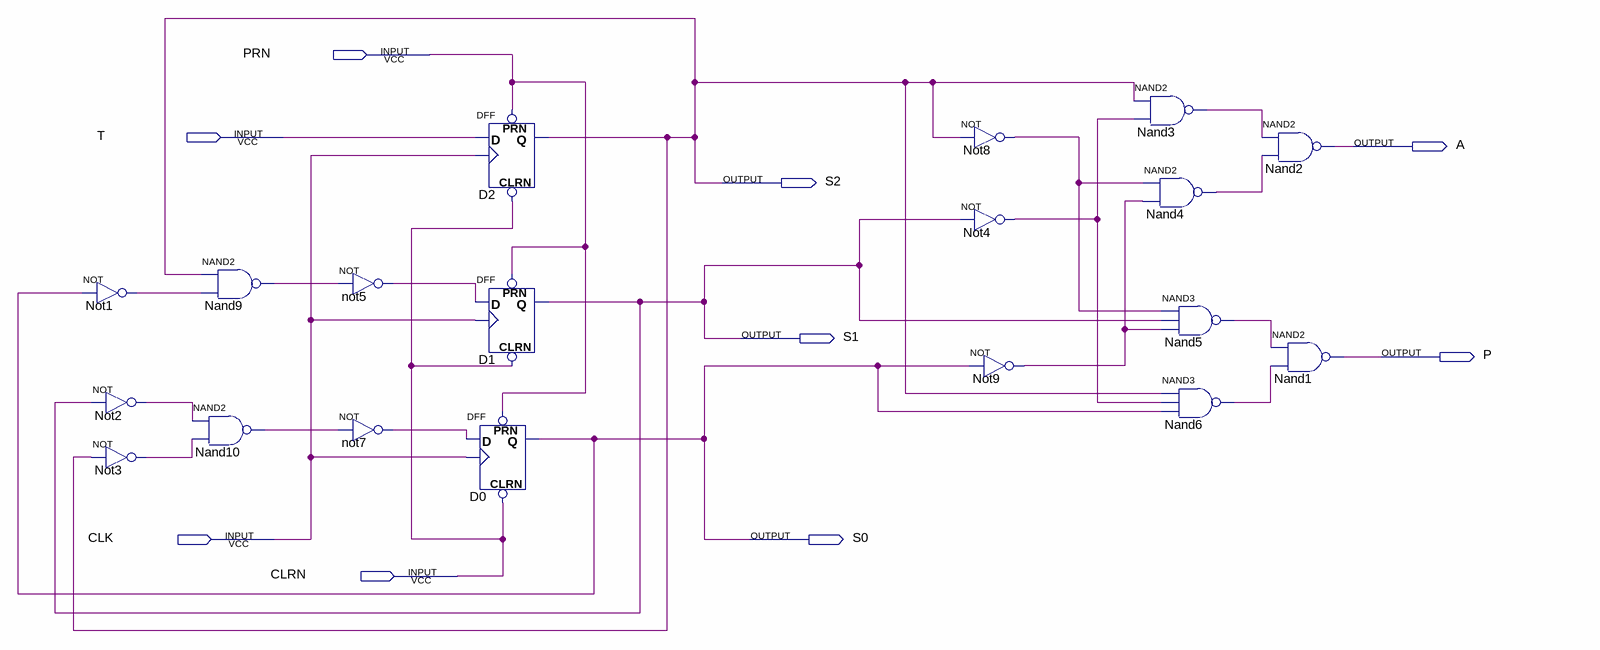
[diagram p0: schematic sheet]
// Quartus schematic Lab5pt2.bdf as structural Verilog: 19 symbols, 9 pins
module Lab5pt2 (
  input  PRN,
  input  T,
  input  CLK,
  input  CLRN,
  output A,
  output S2,
  output S1,
  output P,
  output S0
);

  wire Nand3_out, Nand4_out, Nand5_out, Nand6_out, Nand9_out, Nand10_out, Not1_out, Not2_out, Not3_out,
       Not4_out, not5_out, not7_out, Not8_out, Not9_out;

  not Not1 (Not1_out, S0);
  not Not2 (Not2_out, S1);
  not Not3 (Not3_out, S2);
  nand Nand9 (Nand9_out, S2, Not1_out);
  nand Nand10 (Nand10_out, Not2_out, Not3_out);
  not not5 (not5_out, Nand9_out);
  not not7 (not7_out, Nand10_out);
  DFF D2 (.CLRN(CLRN), .CLK(CLK), .D(T), .PRN(PRN), .Q(S2));
  DFF D1 (.CLRN(CLRN), .CLK(CLK), .D(not5_out), .PRN(PRN), .Q(S1));
  DFF D0 (.CLRN(CLRN), .CLK(CLK), .D(not7_out), .PRN(PRN), .Q(S0));
  not Not8 (Not8_out, S2);
  not Not4 (Not4_out, S1);
  not Not9 (Not9_out, S0);
  nand Nand3 (Nand3_out, S2, Not4_out);
  nand Nand4 (Nand4_out, Not8_out, Not9_out);
  nand Nand5 (Nand5_out, Not8_out, S1, Not9_out);
  nand Nand6 (Nand6_out, S2, Not4_out, S0);
  nand Nand2 (A, Nand3_out, Nand4_out);
  nand Nand1 (P, Nand5_out, Nand6_out);
endmodule
